# EAGLE design board (EAGLE 7.5.0)

## Sheet 1 of 3
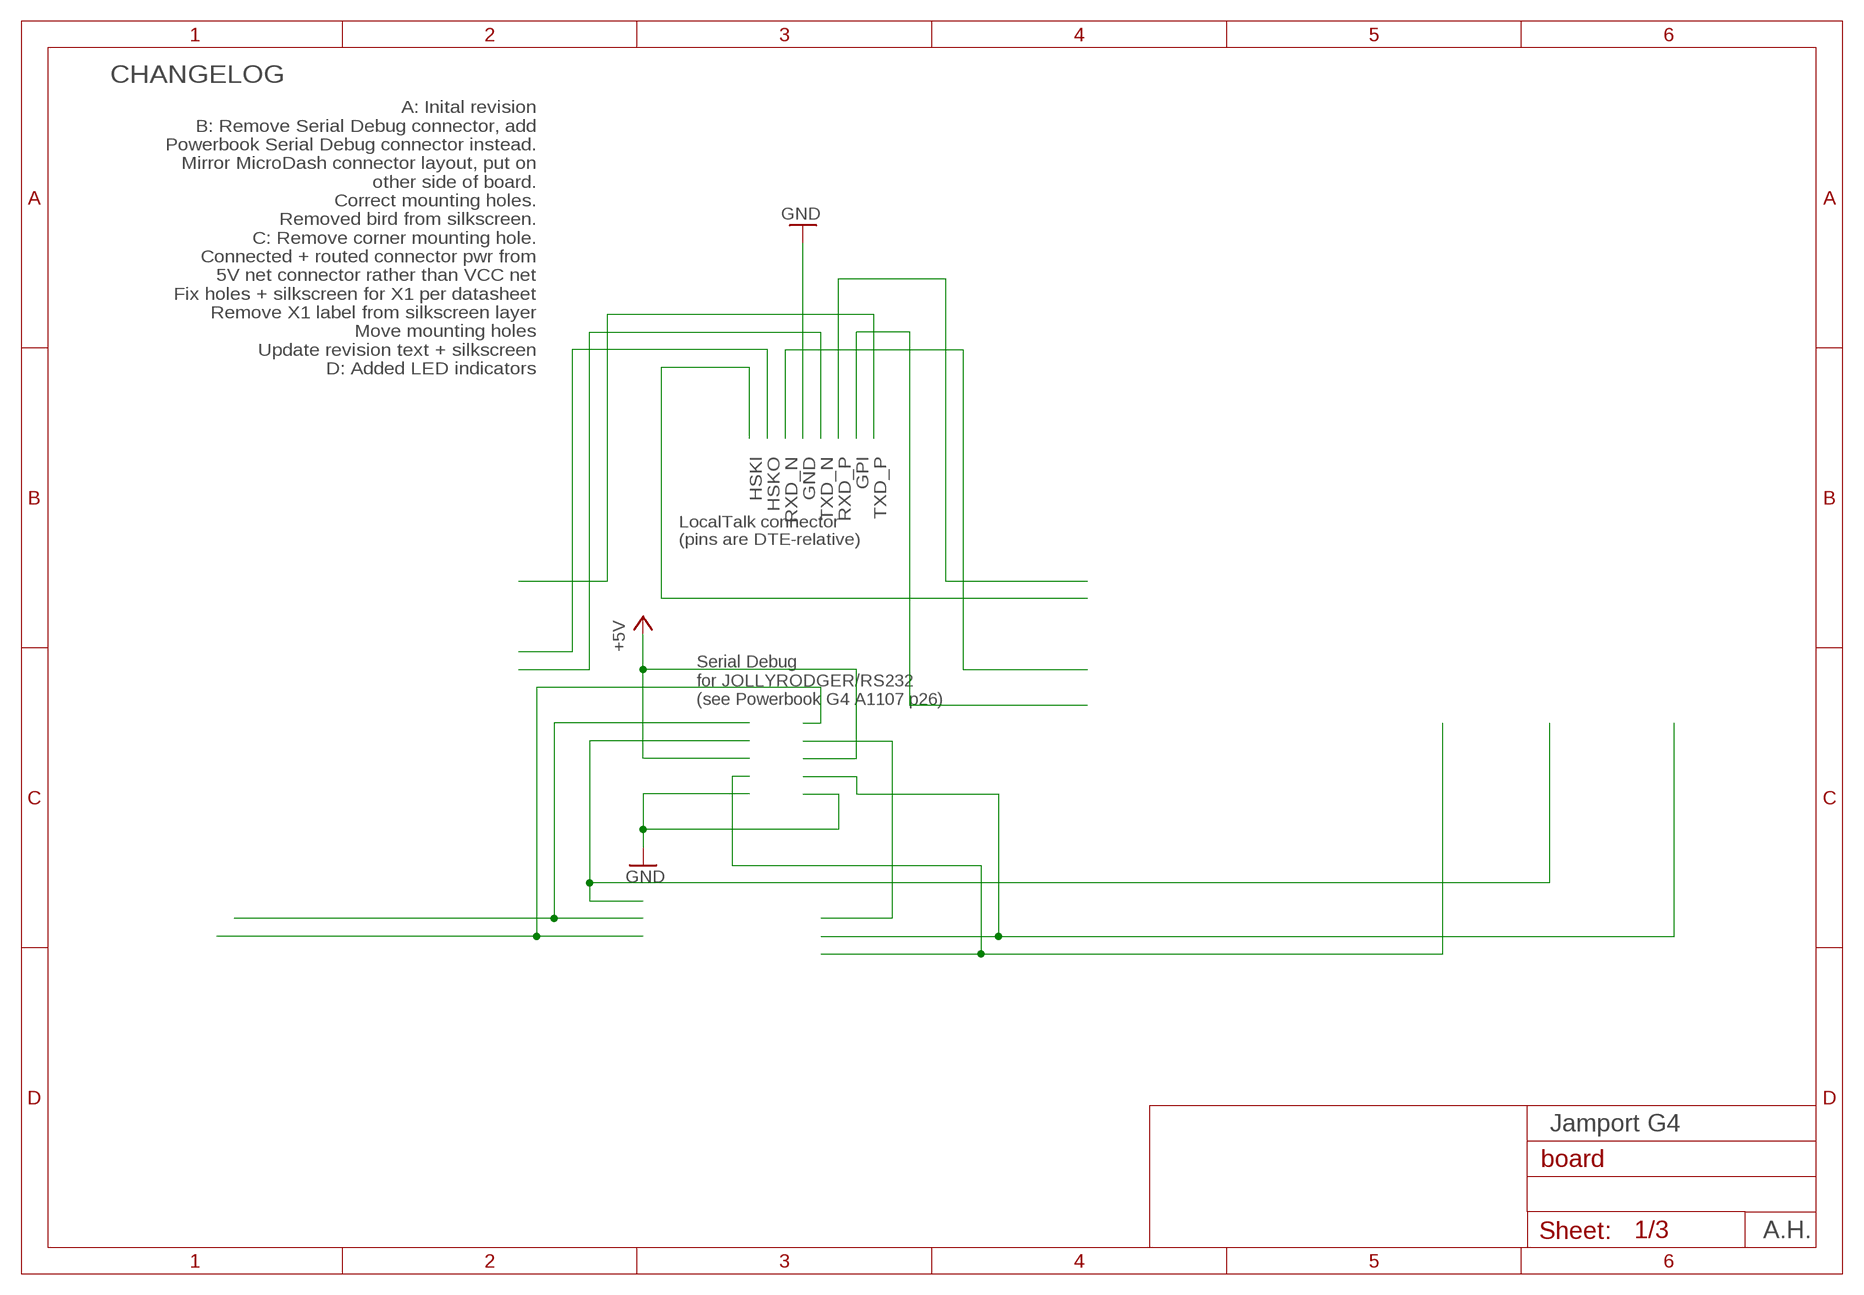
[diagram p0: schematic, sheet 1]

### Notes on the sheet
- CHANGELOG
- A: Inital revision
  B: Remove Serial Debug connector, add
     Powerbook Serial Debug connector instead.
     Mirror MicroDash connector layout, put on
     other side of board.
     Correct mounting holes.
     Removed bird from silkscreen.
  C: Remove corner mounting hole.
     Connected + routed connector pwr from
     5V net connector rather than VCC net
     Fix holes + silkscreen for X1 per datasheet
     Remove X1 label from silkscreen layer
     Move mounting holes
     Update revision text + silkscreen
  D: Added LED indicators
- LocalTalk connector
  (pins are DTE-relative)
- Serial Debug
  for JOLLYRODGER/RS232
  (see Powerbook G4 A1107 p26)
- Jamport G4
- A.H.

## Sheet 2 of 3
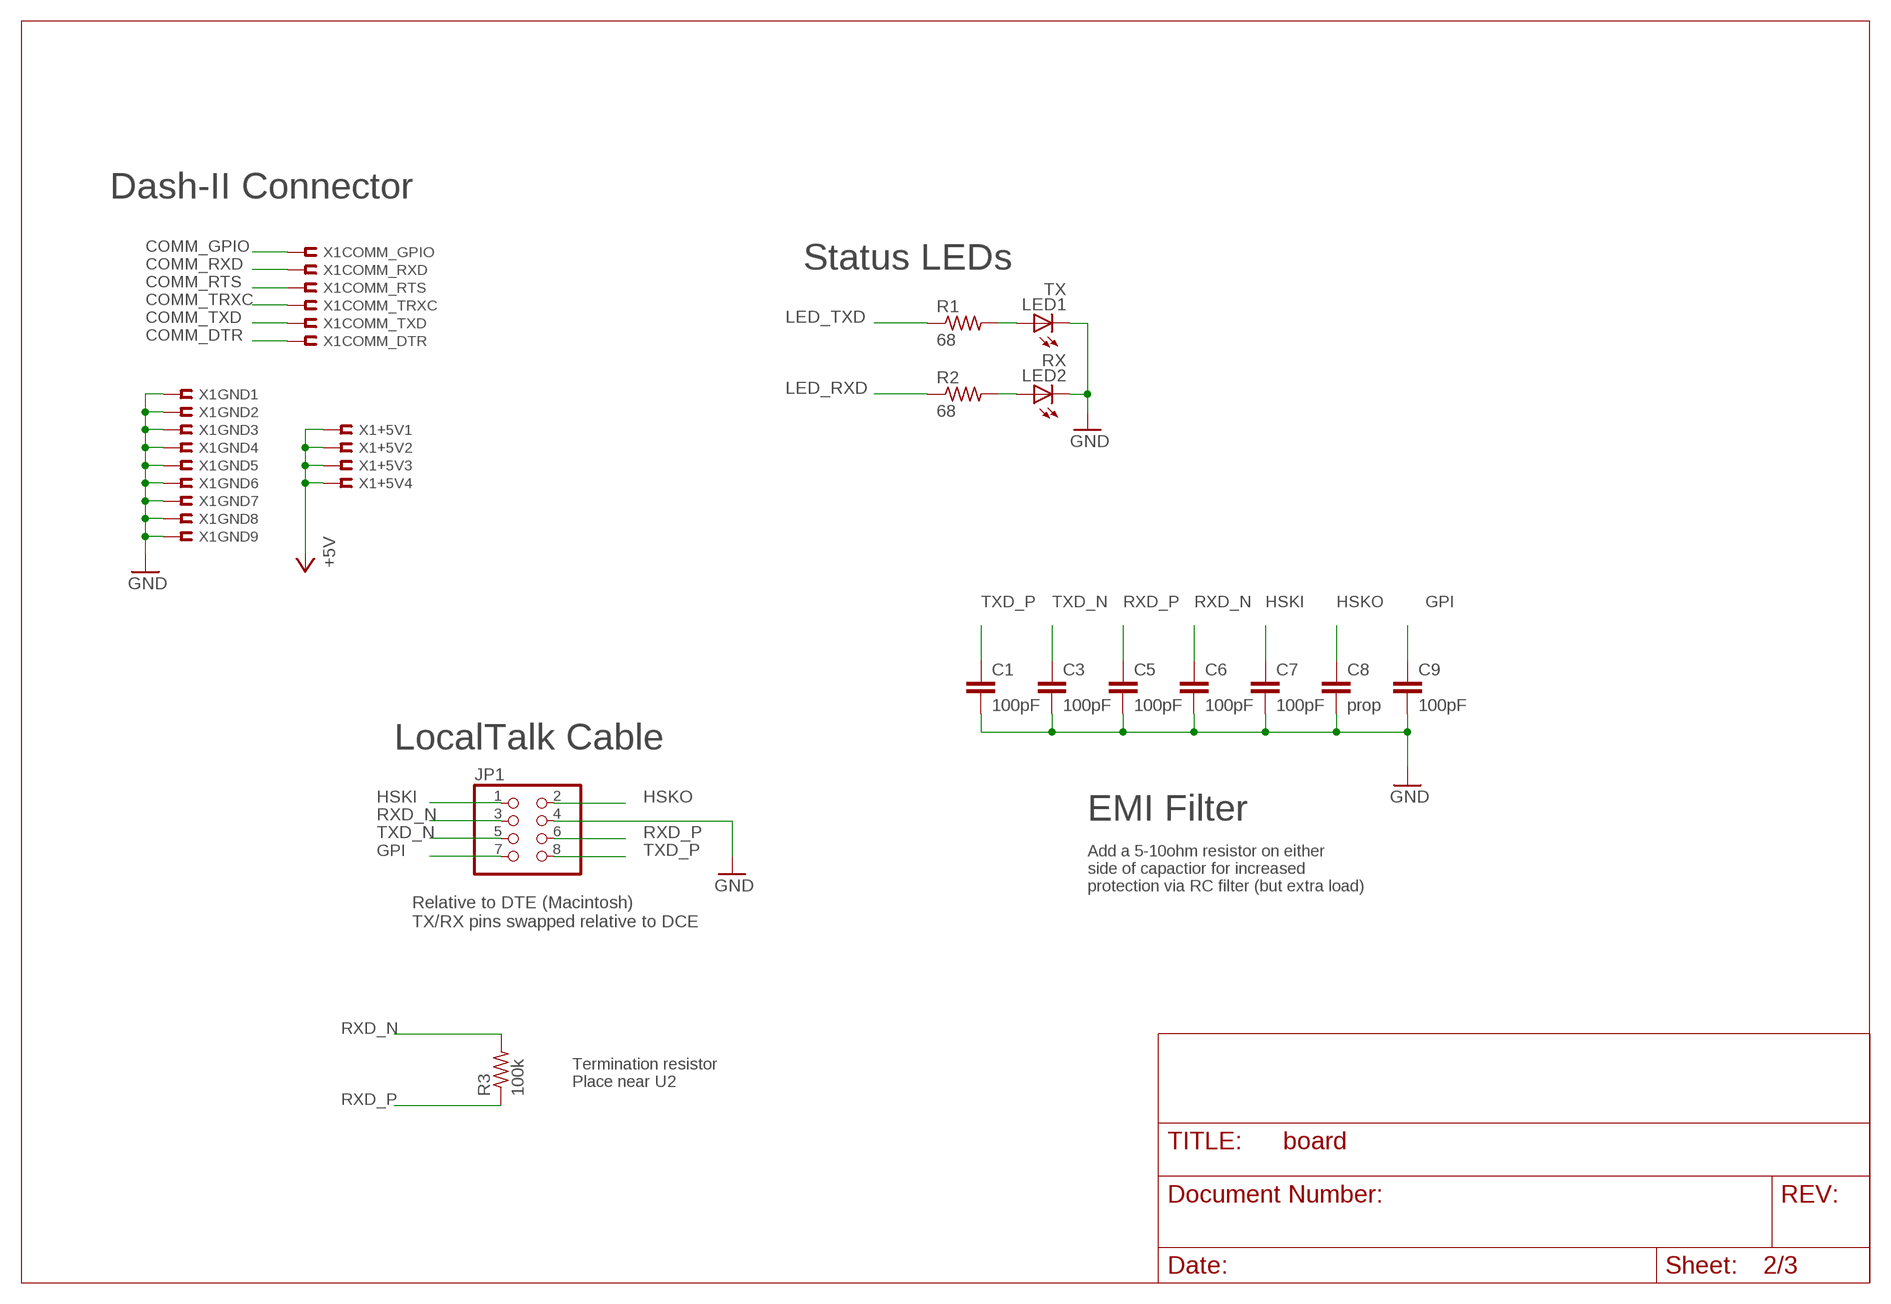
[diagram p1: schematic, sheet 2]

### Parts
C1  100pF  C-EUC0603  [C0603]
C3  100pF  C-EUC0603  [C0603]
C5  100pF  C-EUC0603  [C0603]
C6  100pF  C-EUC0603  [C0603]
C7  100pF  C-EUC0603  [C0603]
C8  prop  C-EUC0603  [C0603]
C9  100pF  C-EUC0603  [C0603]
JP1  PINHD-2X4  [2X04]
LED1  TX  HSME-C265  [CHIPLED_1305]
LED2  RX  HSME-C265  [CHIPLED_1305]
R1  68  R-US_R0603  [R0603]
R2  68  R-US_R0603  [R0603]
R3  100k  R-US_R0603  [R0603]
X1  55091-0409REV  [55091-0409-REV]

### Nets
+5V: X1.37 X1.38 X1.39 X1.40 ; also sheet 1,3
COMM_DTR: X1.9 ; also sheet 1,3
COMM_GPIO: X1.12 ; also sheet 1,3
COMM_RTS: X1.6
COMM_RXD: X1.10 ; also sheet 1,3
COMM_TRXC: X1.15 ; also sheet 1,3
COMM_TXD: X1.13 ; also sheet 1,3
GND: C1.2 C3.2 C5.2 C6.2 C7.2 C8.2 C9.2 JP1.4 LED1.C LED2.C X1.8 X1.11 X1.14 X1.17 X1.22 X1.25 X1.28 X1.31 X1.33 ; also sheet 1,3
GPI: C9.1 JP1.7 ; also sheet 1,3
HSKI: C7.1 JP1.1 ; also sheet 1,3
HSKO: C8.1 JP1.2 ; also sheet 1,3
LED_RXD: R2.1 ; also sheet 3
LED_TXD: R1.1 ; also sheet 3
N$5: LED2.A R2.2
N$6: LED1.A R1.2
RXD_N: C6.1 JP1.3 R3.2 ; also sheet 1,3
RXD_P: C5.1 JP1.6 R3.1 ; also sheet 1,3
TXD_N: C3.1 JP1.5 ; also sheet 1,3
TXD_P: C1.1 JP1.8 ; also sheet 1,3
Unconnected: X1.1 X1.2 X1.3 X1.4 X1.5 X1.7 X1.16 X1.18 X1.19 X1.20 X1.21 X1.23 X1.24 X1.26 X1.27 X1.29 X1.30 X1.32 X1.34 X1.35 X1.36

### Notes on the sheet
- Dash-II Connector
- Status LEDs
- LocalTalk Cable
- EMI Filter
- Add a 5-10ohm resistor on either
  side of capactior for increased
  protection via RC filter (but extra load)
- Relative to DTE (Macintosh)
  TX/RX pins swapped relative to DCE
- Termination resistor
  Place near U2

## Sheet 3 of 3
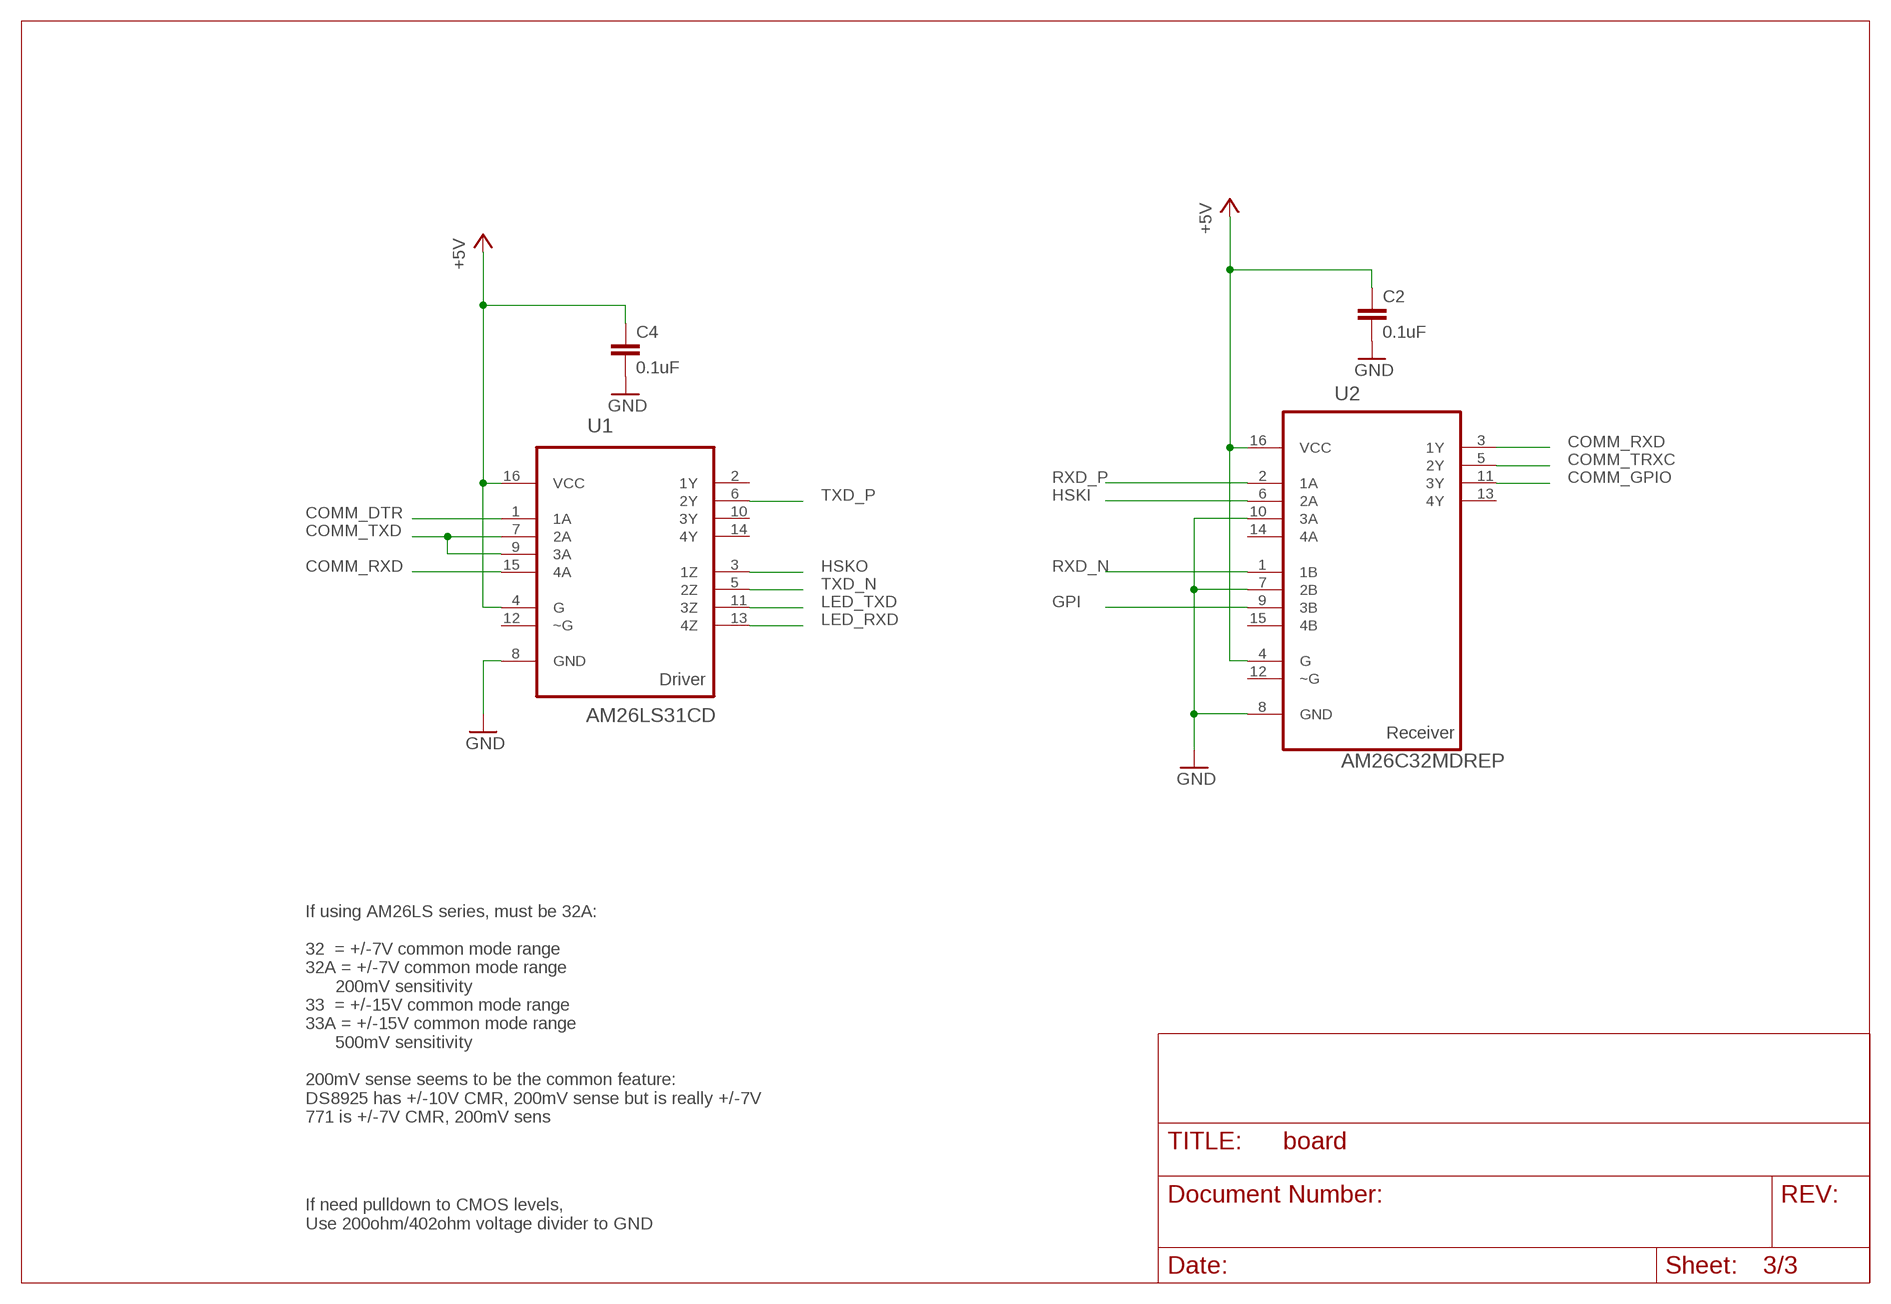
[diagram p2: schematic, sheet 3]

### Parts
C2  0.1uF  C-EUC0603  [C0603]
C4  0.1uF  C-EUC0603  [C0603]
U1  AM26LS31CD  [SOIC127P600X175-16N]
U2  AM26C32MDREP  [SOIC127P600X175-16N]

### Nets
+5V: C2.1 C4.1 U1.4(G) U1.16(VCC) U2.4(G) U2.16(VCC) ; also sheet 1,2
COMM_DTR: U1.1(1A) ; also sheet 1,2
COMM_GPIO: U2.11(3Y) ; also sheet 1,2
COMM_RXD: U1.15(4A) U2.3(1Y) ; also sheet 1,2
COMM_TRXC: U2.5(2Y) ; also sheet 1,2
COMM_TXD: U1.7(2A) U1.9(3A) ; also sheet 1,2
GND: C2.2 C4.2 U1.8(GND) U2.7(2B) U2.8(GND) U2.10(3A) ; also sheet 1,2
GPI: U2.9(3B) ; also sheet 1,2
HSKI: U2.6(2A) ; also sheet 1,2
HSKO: U1.3(1Z) ; also sheet 1,2
LED_RXD: U1.13(4Z) ; also sheet 2
LED_TXD: U1.11(3Z) ; also sheet 2
RXD_N: U2.1(1B) ; also sheet 1,2
RXD_P: U2.2(1A) ; also sheet 1,2
TXD_N: U1.5(2Z) ; also sheet 1,2
TXD_P: U1.6(2Y) ; also sheet 1,2
Unconnected: U1.2(1Y) U1.10(3Y) U1.12(~G) U1.14(4Y) U2.12(~G) U2.13(4Y) U2.14(4A) U2.15(4B)

### Notes on the sheet
- Driver
- Receiver
- If using AM26LS series, must be 32A:
  
  32  = +/-7V common mode range
  32A = +/-7V common mode range
        200mV sensitivity
  33  = +/-15V common mode range
  33A = +/-15V common mode range
        500mV sensitivity
  
  200mV sense seems to be the common feature:
  DS8925 has +/-10V CMR, 200mV sense but is really +/-7V
  771 is +/-7V CMR, 200mV sens
- If need pulldown to CMOS levels,
  Use 200ohm/402ohm voltage divider to GND

## Library data of the parts
C1 C3 C5-C9 = rcl:C-EU: CAPACITOR, European symbol
C2 C4 = resistor:C-EU: CAPACITOR, European symbol
JP1 = pinhead:PINHD-2X4: PIN HEADER
LED1 LED2 = macintosh:HSM*-C265: Broadcom/Avago Reverse-Mounted LED Reverse mounted LED.; COLOR: GREEN
R1-R3 = rcl:R-US_: RESISTOR, American symbol
U1 = Texas Instruments_By_element14_Batch_1:AM26LS31CD: QUADRUPLE DIFFERENTIAL LINE DRIVER; MPN: AM26LS31CD; OC_FARNELL: 1648735; OC_NEWARK: 06F1107; PACKAGE: SOIC-16; SUPPLIER: Texas Instruments
U2 = Texas Instruments_By_element14_Batch_1:AM26C32MDREP: QUADRUPLE DIFFERENTIAL LINE RECEIVER; MPN: AM26C32MDREP; OC_FARNELL: -; OC_NEWARK: 79R7822; PACKAGE: SOIC-16; SUPPLIER: Texas Instruments
X1 = macintosh:55091-0409: 0.635 mm PITCH B TO B CONN. Source: http://www.molex.com/pdm_docs/sd/550911609_sd.pdf

## Board
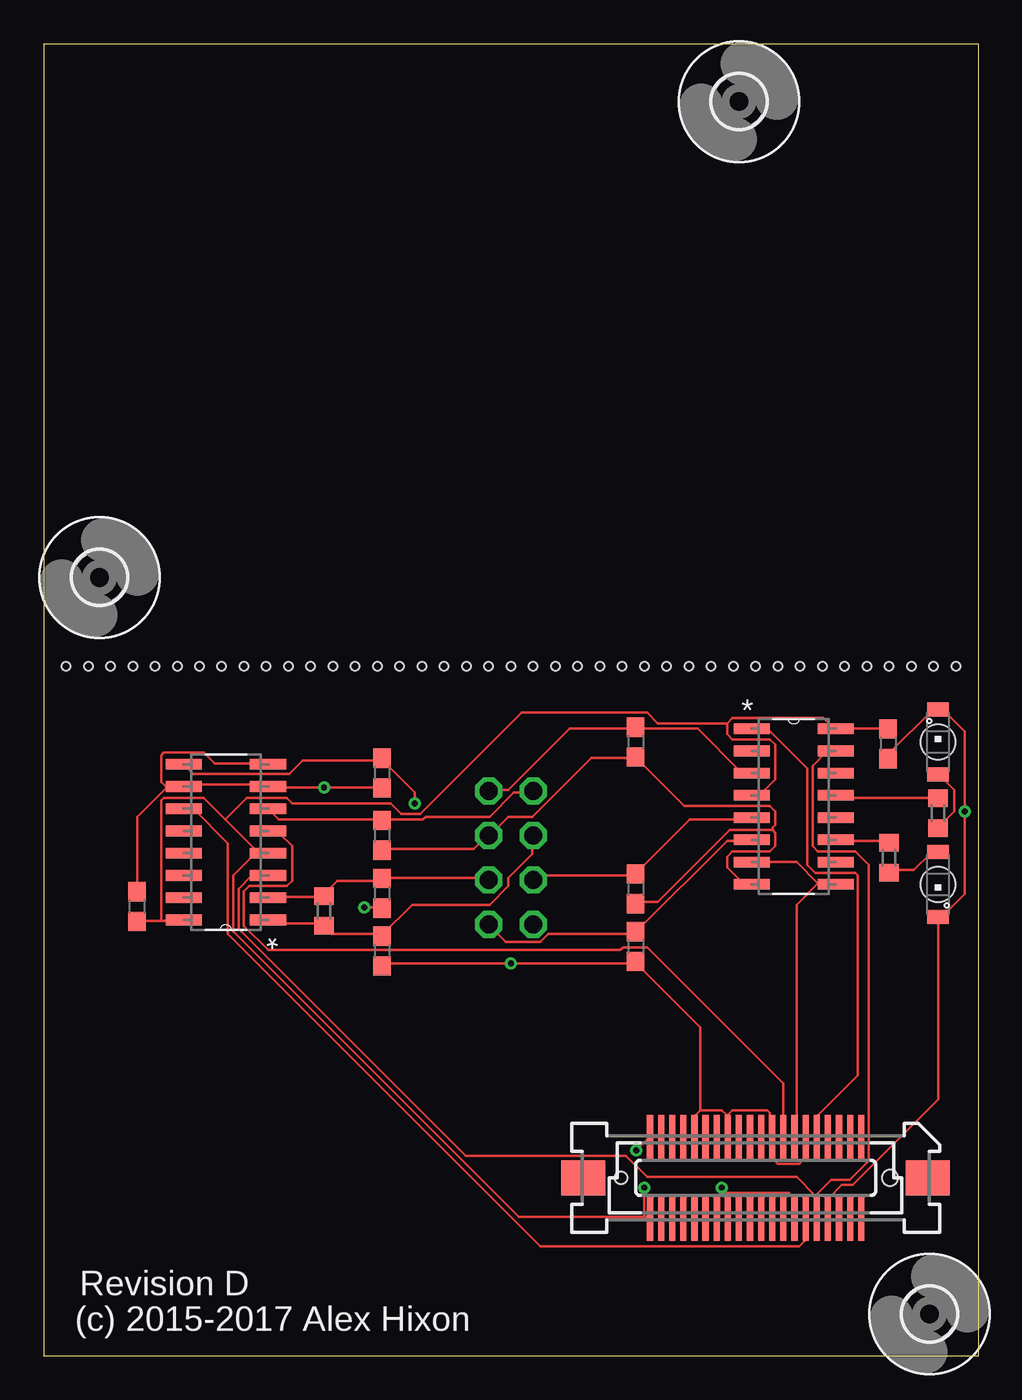
[diagram p3: board, top side]
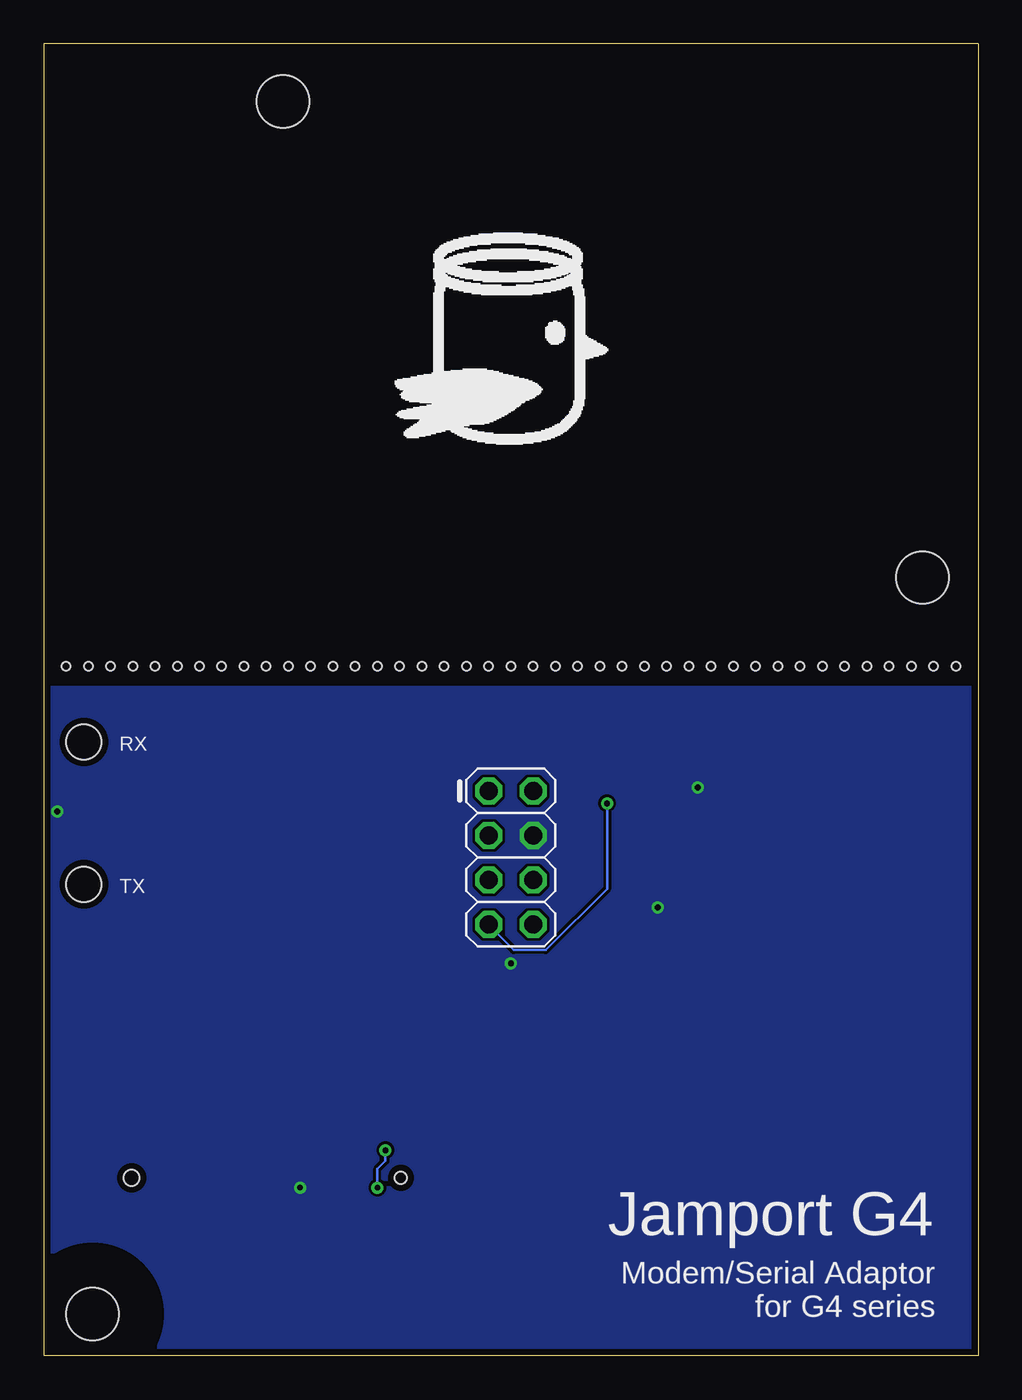
[diagram p4: board, bottom side, seen from below]

Size 53.34 x 74.93 mm. Coordinates in mm from the lower left corner, seen from the top.
Outline: 0,74.92 0,0 53.34,0 53.34,74.93 0,74.93
Copper layers (1*16): Top 0.0356mm / dielectric 1.5011mm / Bottom 0.0356mm
Design rules "LaenPCBOrder": minimum track width 6mil, minimum drill 13mil, track to track 6mil, track to pad 6mil, pad to pad 6mil, via to via 6mil, smd to smd 6mil, copper to edge 15mil, drill to drill 6mil, minimum pad ring 7mil, minimum via ring 7mil, stop-mask expansion 3mil, vias tented up to drill 0mil, thermal gap 10mil
Holes 0.5 mm at 1.27,39.37 3.81,39.37 6.35,39.37 8.89,39.37 11.43,39.37 13.97,39.37 16.51,39.37 19.05,39.37 21.59,39.37 24.13,39.37 26.67,39.37 29.21,39.37 31.75,39.37 34.29,39.37 36.83,39.37 39.37,39.37 41.91,39.37 43.18,39.37 44.45,39.37 45.72,39.37 46.99,39.37 48.26,39.37 49.53,39.37 50.8,39.37 52.07,39.37 40.64,39.37 38.1,39.37 33.02,39.37 30.48,39.37 27.94,39.37 25.4,39.37 35.56,39.37 22.86,39.37 20.32,39.37 17.78,39.37 15.24,39.37 12.7,39.37 10.16,39.37 7.62,39.37 5.08,39.37 2.54,39.37

### Footprints (pad centres in the part's own frame; a part is rotated, then mirrored left to right if it is on the bottom)
C0603 = smd 1.1 x 1: 1 -0.85,0; 2 0.85,0
2X04 = drill 1.016 octagon: 1 -3.81,-1.27; 2 -3.81,1.27; 3 -1.27,-1.27; 4 -1.27,1.27; 5 1.27,-1.27; 6 1.27,1.27; 7 3.81,-1.27; 8 3.81,1.27
CHIPLED_1305 = smd 1.25 x 0.8: A 0,-1.85; C 0,1.85 | hole 2: 0,0
R0603 = smd 1 x 1.1: 1 -0.85,0; 2 0.85,0
SOIC127P600X175-16N = smd 2.057 x 0.61: 1 -4.801,8.89; 2 -4.801,7.62; 3 -4.801,6.35; 4 -4.801,5.08; 5 -4.801,3.81; 6 -4.801,2.54; 7 -4.801,1.27; 8 -4.801,0; 9 0,0; 10 0,1.27; 11 0,2.54; 12 0,3.81; 13 0,5.08; 14 0,6.35; 15 0,7.62; 16 0,8.89
3,0 = hole 3: 0,0
55091-0409-REV = smd 0.35 x 2.5: 1 6.032,2.35; 2 6.032,-2.35; 3 5.397,2.35; 4 5.397,-2.35; 5 4.763,2.35; 6 4.763,-2.35; 7 4.128,2.35; 8 4.128,-2.35; 9 3.493,2.35; 10 3.493,-2.35; 11 2.857,2.35; 12 2.857,-2.35; 13 2.223,2.35; 14 2.223,-2.35; 15 1.587,2.35; 16 1.587,-2.35; 17 0.953,2.35; 18 0.953,-2.35; 19 0.318,2.35; 20 0.318,-2.35; 21 -0.318,2.35; 22 -0.318,-2.35; 23 -0.953,2.35; 24 -0.953,-2.35; 25 -1.587,2.35; 26 -1.587,-2.35; 27 -2.223,2.35; 28 -2.223,-2.35; 29 -2.857,2.35; 30 -2.857,-2.35; 31 -3.493,2.35; 32 -3.493,-2.35; 33 -4.128,2.35; 34 -4.128,-2.35; 35 -4.763,2.35; 36 -4.763,-2.35; 37 -5.397,2.35; 38 -5.397,-2.35; 39 -6.032,2.35; 40 -6.032,-2.35 | smd 2.5 x 2: M1 -9.835,0; M2 9.835,0 | hole 0.7: -7.685,0 | hole 0.9: 7.685,0

### Placement (x,y rotation side)
C1  33.78,23.37 270 top
C2  48.21,34.95 270 top
C3  33.78,26.67 270 top
C4  5.33,25.65 90 top
C5  19.3,26.42 270 top
C6  19.3,23.11 270 top
C7  19.3,29.72 270 top
C8  33.78,35.05 270 top
C9  19.3,33.27 270 top
JP1  26.67,28.45 270 bottom
LED1  51.05,26.92 180 top
LED2  51.05,35.05 0 top
R1  48.26,28.45 270 top
R2  51.05,30.99 270 top
R3  16,25.4 270 top
U1  45.21,26.92 0 top
U2  8,33.78 180 top
U$1  [3,0]  50.56,2.38 0 top
U$2  [3,0]  3.17,44.45 0 top
U$3  [3,0]  39.69,71.63 0 top
X1  40.64,10.16 0 top

### Tracks (layer width: path | path; a pad name or v marks a point on that pad's centre or on a via)
+5V  (via drill 0.33)
  Top 0.152: C2.1 48.16,35.81 U1.16 45.11,35.81 44.5,36.42 39.32,36.42 39.01,36.12 | U1.4 40.84,32 41.76,32.92 41.76,34.9 41.45,35.2 39.32,35.2 39.01,35.51 39.01,36.12 | X1.37 35.2,12.5 34.75,12.5 X1.39 34.59,12.5 v33.83,11.73 | X1.38 35.2,7.77 34.75,7.77 X1.40 34.59,7.92 34.29,7.92 | 6.71,24.84 7.92,24.84 U2.16 | 6.71,24.84 5.33,24.84 C4.1 | 12.19,28.8 12.8,28.8 U2.4 12.19,28.8 | 10.36,30.63 9.14,31.85 6.86,31.85 6.71,31.7 6.71,24.84 | 10.36,30.63 12.19,28.8 | 34.29,7.92 27.13,7.92 10.82,24.23 10.82,27.43 12.19,28.8 | 34.29,7.92 v34.29,9.6 | 39.01,36.12 35.05,36.12 34.44,36.73 27.28,36.73 21.49,30.94 20.42,30.94 19.81,31.55 14.17,31.55 13.87,31.85 11.58,31.85 10.36,30.63
  Bottom 0.152: v33.83,11.73 33.83,11.12 34.29,10.67 v34.29,9.6
COMM_DTR
  Top 0.152: U1.1 41.3,35.81 43.59,33.53 43.59,28.04 44.04,27.58 46.33,27.58 46.48,27.43 46.48,16 44.2,13.72 44.2,12.65 X1.9
COMM_GPIO
  Top 0.152: U2.11 8.53,31.24 10.52,29.26 10.52,24.08 28.35,6.25 43.13,6.25 43.43,6.55 43.43,7.77 X1.12
COMM_RXD
  Top 0.152: U2.3 11.89,27.43 11.12,26.67 11.12,24.38 24.08,11.43 33.22,11.43 34.44,10.21 42.98,10.21 44.04,9.14 | 44.04,9.14 44.04,7.92 X1.10 | 44.04,9.14 44.96,10.06 46.02,10.06 47.09,11.12 47.09,28.04 46.33,28.8 44.2,28.8 43.89,29.11 43.89,33.68 44.65,34.44 45.11,34.44 U1.15
COMM_TRXC
  Top 0.152: U2.5 12.8,29.87 13.41,29.87 14.17,29.11 14.17,27.13 13.87,26.82 11.73,26.82 11.43,26.52 11.43,24.54 12.8,23.16 32.92,23.16 33.07,23.32 34.44,23.32 42.22,15.54 42.22,12.65 X1.15
COMM_TXD
  Top 0.152: U1.7 42.98,28.19 44.2,26.98 | 44.2,26.98 45.11,26.98 U1.9 44.2,26.98 | 44.2,26.98 42.98,25.76 42.98,12.65 X1.13
GND  (via drill 0.33)
  Top 0.152: 51.05,36.88 50.75,36.88 48.31,34.44 48.31,34.14 C2.2 | 51.05,36.88 51.36,36.88 52.58,35.66 v52.58,31.09 52.58,26.36 51.36,25.15 51.05,25.15 LED1.C 51.05,14.63 46.18,9.75 45.57,9.75 44.81,8.99 44.81,7.92 X1.8 | 51.05,36.88 LED2.C | X1.33 36.58,12.5 37.03,12.5 X1.31 37.19,12.65 37.19,13.72 37.49,14.02 | 39.01,13.72 39.01,12.65 X1.25 39.01,13.72 | 39.01,13.72 38.71,14.02 37.49,14.02 | 39.01,13.72 39.32,14.02 41.3,14.02 41.45,13.87 41.45,12.65 X1.17 41.6,12.5 41.6,11.28 41.91,10.97 43.13,10.97 43.43,11.28 43.43,12.5 X1.11 | C6.2 19.36,22.4 v26.67,22.4 33.68,22.4 C1.2 33.83,22.4 37.49,18.75 37.49,14.02 | C9.2 19.2,32.46 v16,32.46 12.8,32.46 U2.7 12.8,32.61 8.08,32.61 U2.10 | C4.2 5.33,30.79 7.01,32.46 | 7.01,32.46 7.92,32.46 U2.10 | 7.01,32.46 6.71,32.77 6.71,34.29 6.86,34.44 9.14,34.44 9.75,33.83 12.8,33.83 U2.8 | 7.01,32.46 U2.10 | 41.6,30.02 39.17,30.02 35.05,25.91 33.83,25.91 C3.2 | 41.6,30.02 41.76,29.87 41.76,29.11 41.45,28.8 39.32,28.8 39.01,28.5 39.01,27.89 39.93,26.98 40.39,26.98 U1.8 | 38.71,9.3 38.56,9.14 38.56,7.92 X1.28 | 40.08,9.3 38.71,9.3 | 40.08,9.3 40.23,9.14 40.23,7.92 X1.22 | 40.08,9.3 42.52,9.3 42.82,8.99 42.82,7.92 X1.14 | v18.29,25.6 19.2,25.6 C5.2 | C7.2 19.36,28.96 24.54,28.96 25.3,29.72 JP1.4 25.45,29.72 26.52,30.79 27.89,30.79 31.24,34.14 33.68,34.14 C8.2 33.83,34.14 36.58,31.39 41.45,31.39 41.76,31.09 41.76,30.33 41.6,30.18 41.6,30.02 | v38.71,9.6 38.71,9.3
  pour Bottom (rank 6, no thermals): 0,38.1 53.34,38.1 53.34,0 0,0
GPI  (via drill 0.33)
  Top 0.152: U2.9 8.08,33.68 8.53,33.22 14.02,33.22 14.78,33.98 19.2,33.98 C9.1 19.36,33.98 21.18,32.16 v21.18,31.55
  Bottom 0.152: v21.18,31.55 21.18,26.67 24.69,23.16 26.52,23.16 27.89,24.54 JP1.7
HSKI
  Top 0.152: U2.6 13.41,30.63 19.2,30.63 C7.1 19.36,30.63 21.64,30.63 21.79,30.79 25.45,30.79 26.82,32.16 27.89,32.16 JP1.1
HSKO
  Top 0.152: U1.3 40.39,33.38 39.78,33.38 37.34,35.81 33.83,35.81 C8.1 33.68,35.81 30.02,35.81 26.52,32.31 25.45,32.31 JP1.2
LED_RXD
  Top 0.152: R2.1 51.05,31.85 45.41,31.85 45.26,32 U1.13
LED_TXD
  Top 0.152: R1.1 48.16,29.41 45.26,29.41 U1.11
N$5
  Top 0.152: R2.2 51.05,30.18 51.97,31.09 51.97,32.31 51.05,33.22 LED2.A
N$6
  Top 0.152: R1.2 48.31,27.74 49.68,27.74 50.6,28.65 51.05,28.65 LED1.A
RXD_N
  Top 0.152: U2.1 12.8,24.84 12.95,24.69 16,24.69 R3.2 16,24.54 16.46,24.08 19.2,24.08 C6.1 19.36,24.08 21.03,25.76 25.45,25.76 26.52,26.82 26.52,27.28 27.89,28.65 27.89,29.72 JP1.3
RXD_P
  Top 0.152: U2.2 12.8,26.21 16,26.21 R3.1 16,26.36 16.76,27.13 19.2,27.13 C5.1 19.36,27.28 25.3,27.28 JP1.6
TXD_N
  Top 0.152: JP1.5 28.19,27.43 33.68,27.43 C3.1 33.83,27.58 36.88,30.63 40.39,30.63 U1.5
TXD_P
  Top 0.152: JP1.8 25.45,24.54 26.36,23.62 28.35,23.62 28.8,24.08 33.68,24.08 C1.1 33.83,24.23 39.01,29.41 40.39,29.41 U1.6

### Text on the board
tPlace: Revision D | (c) 2015-2017 Alex Hixon
bPlace: Jamport G4 | Modem/Serial Adaptor / for G4 series